# EasyEDA Pro project 延时继电器 -(4-11).eprj, board PCB
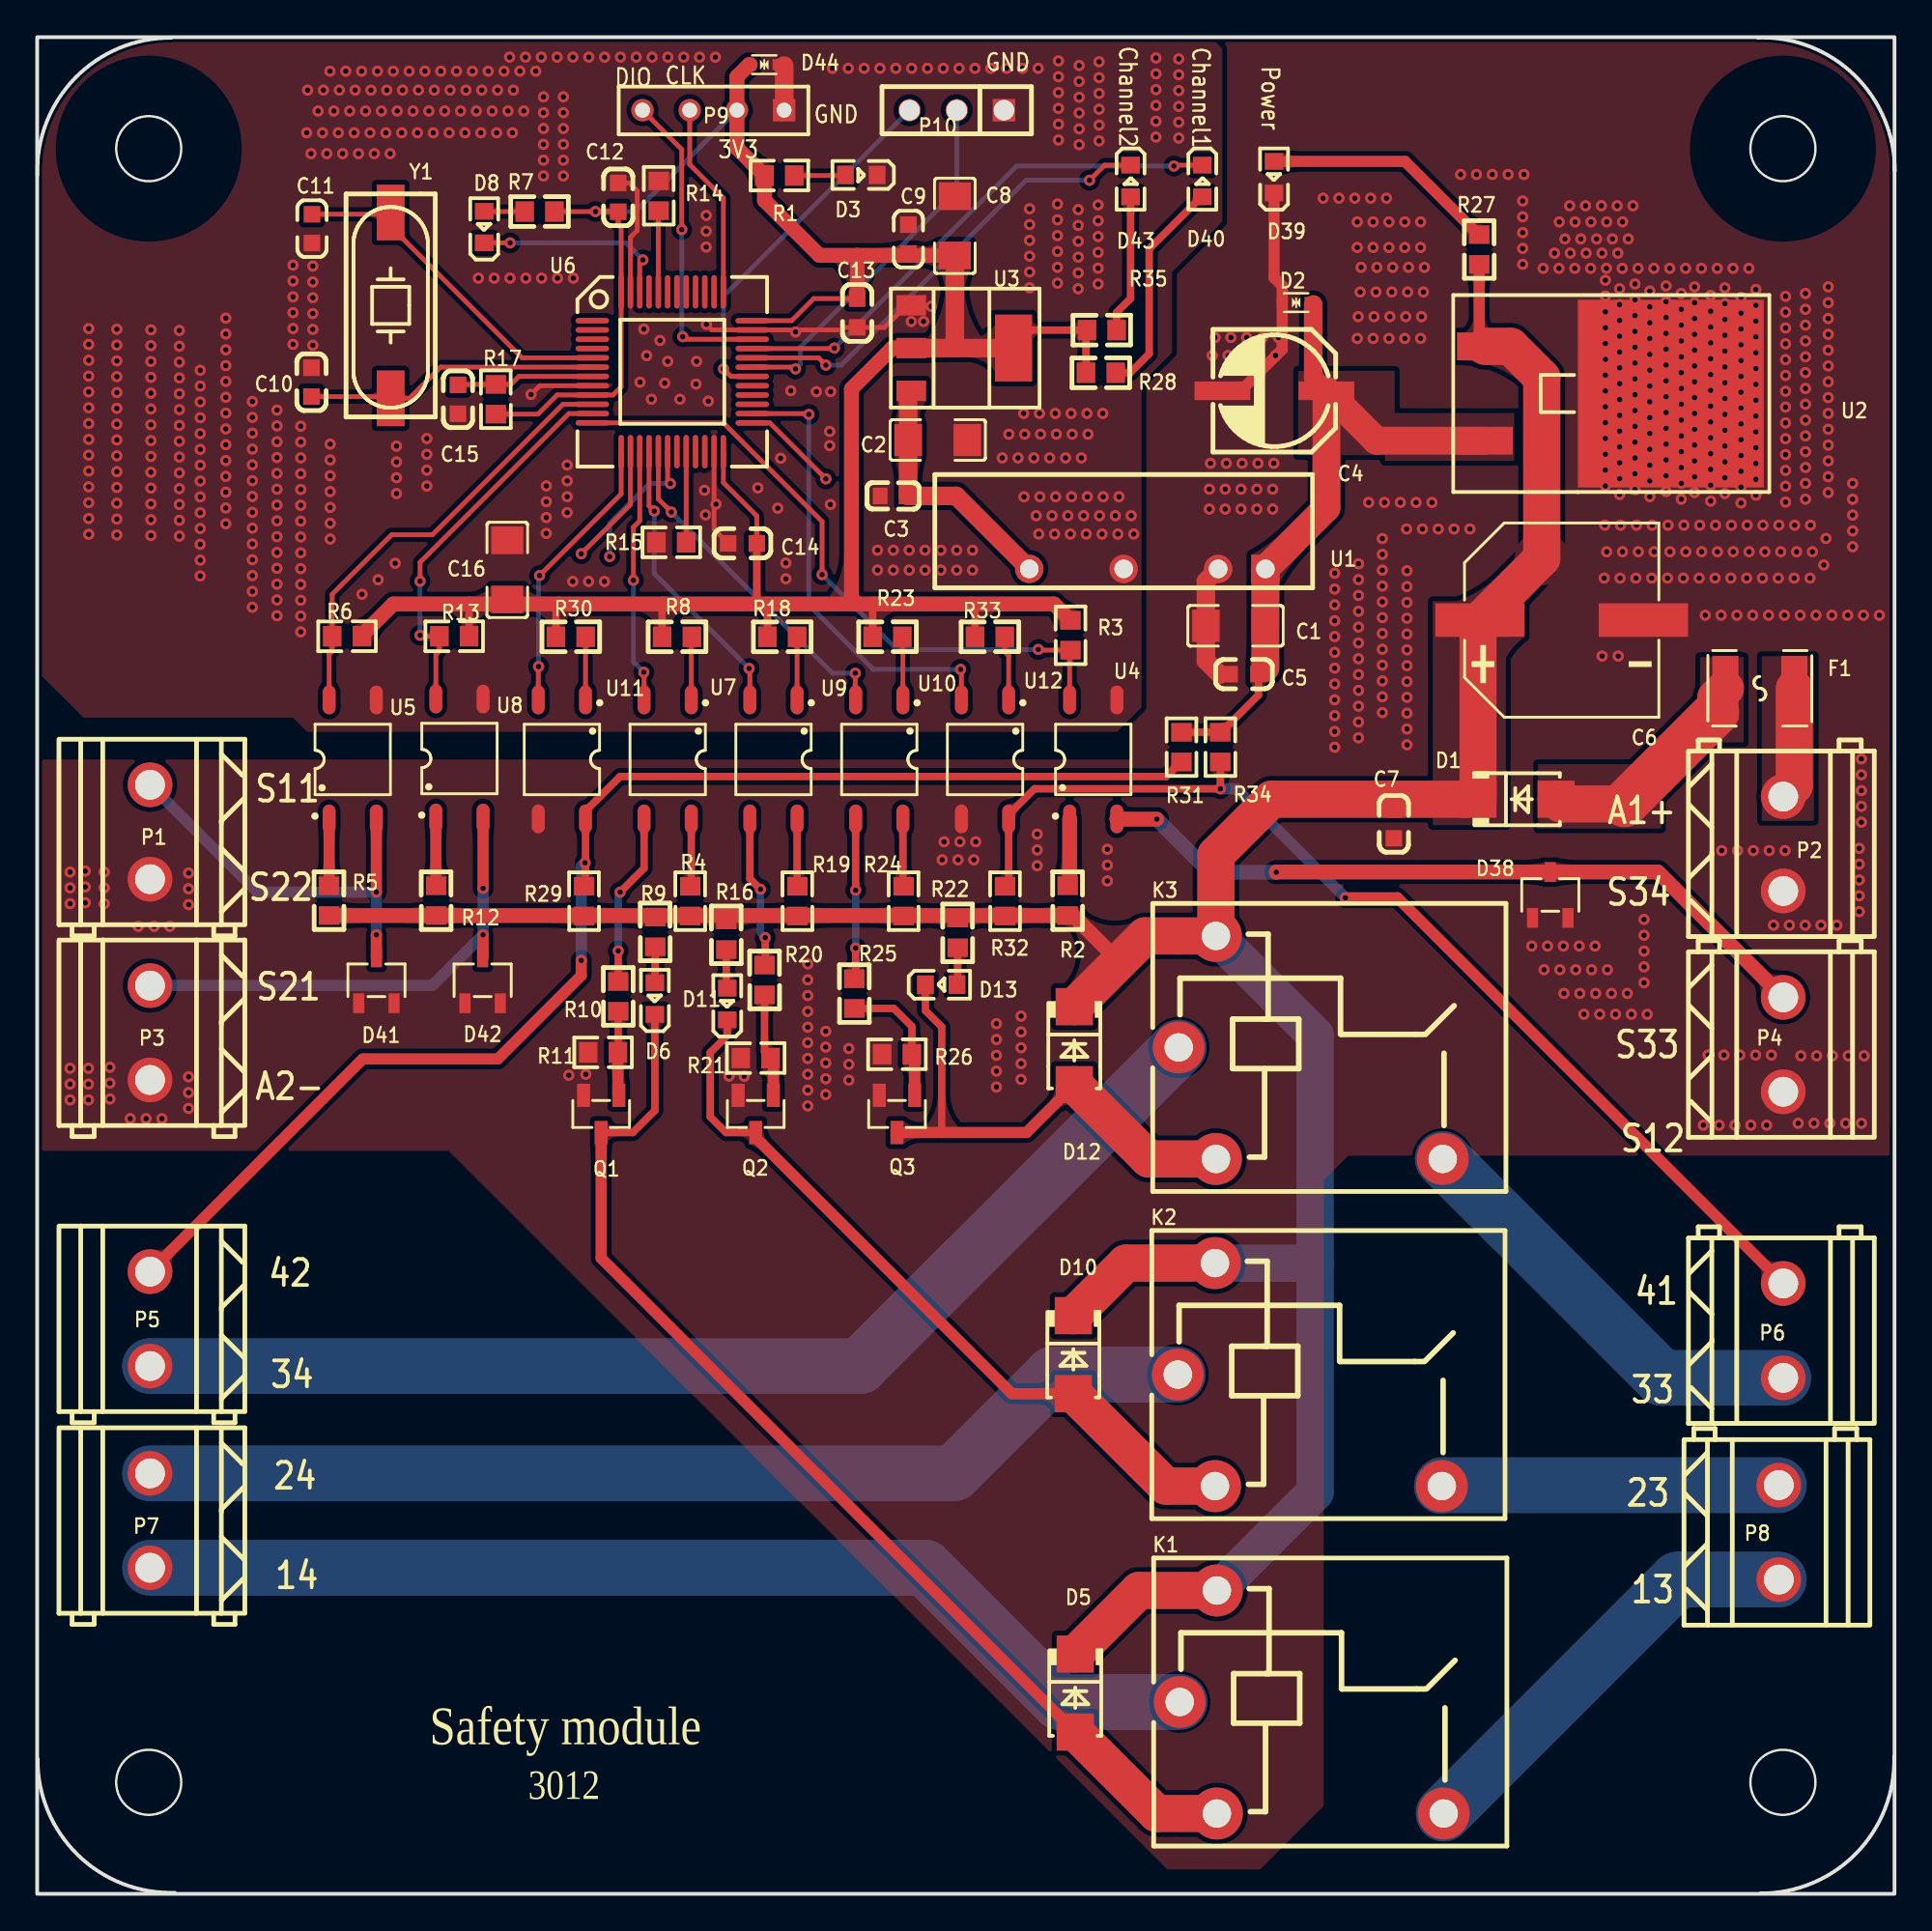
[diagram p2: board, top side]
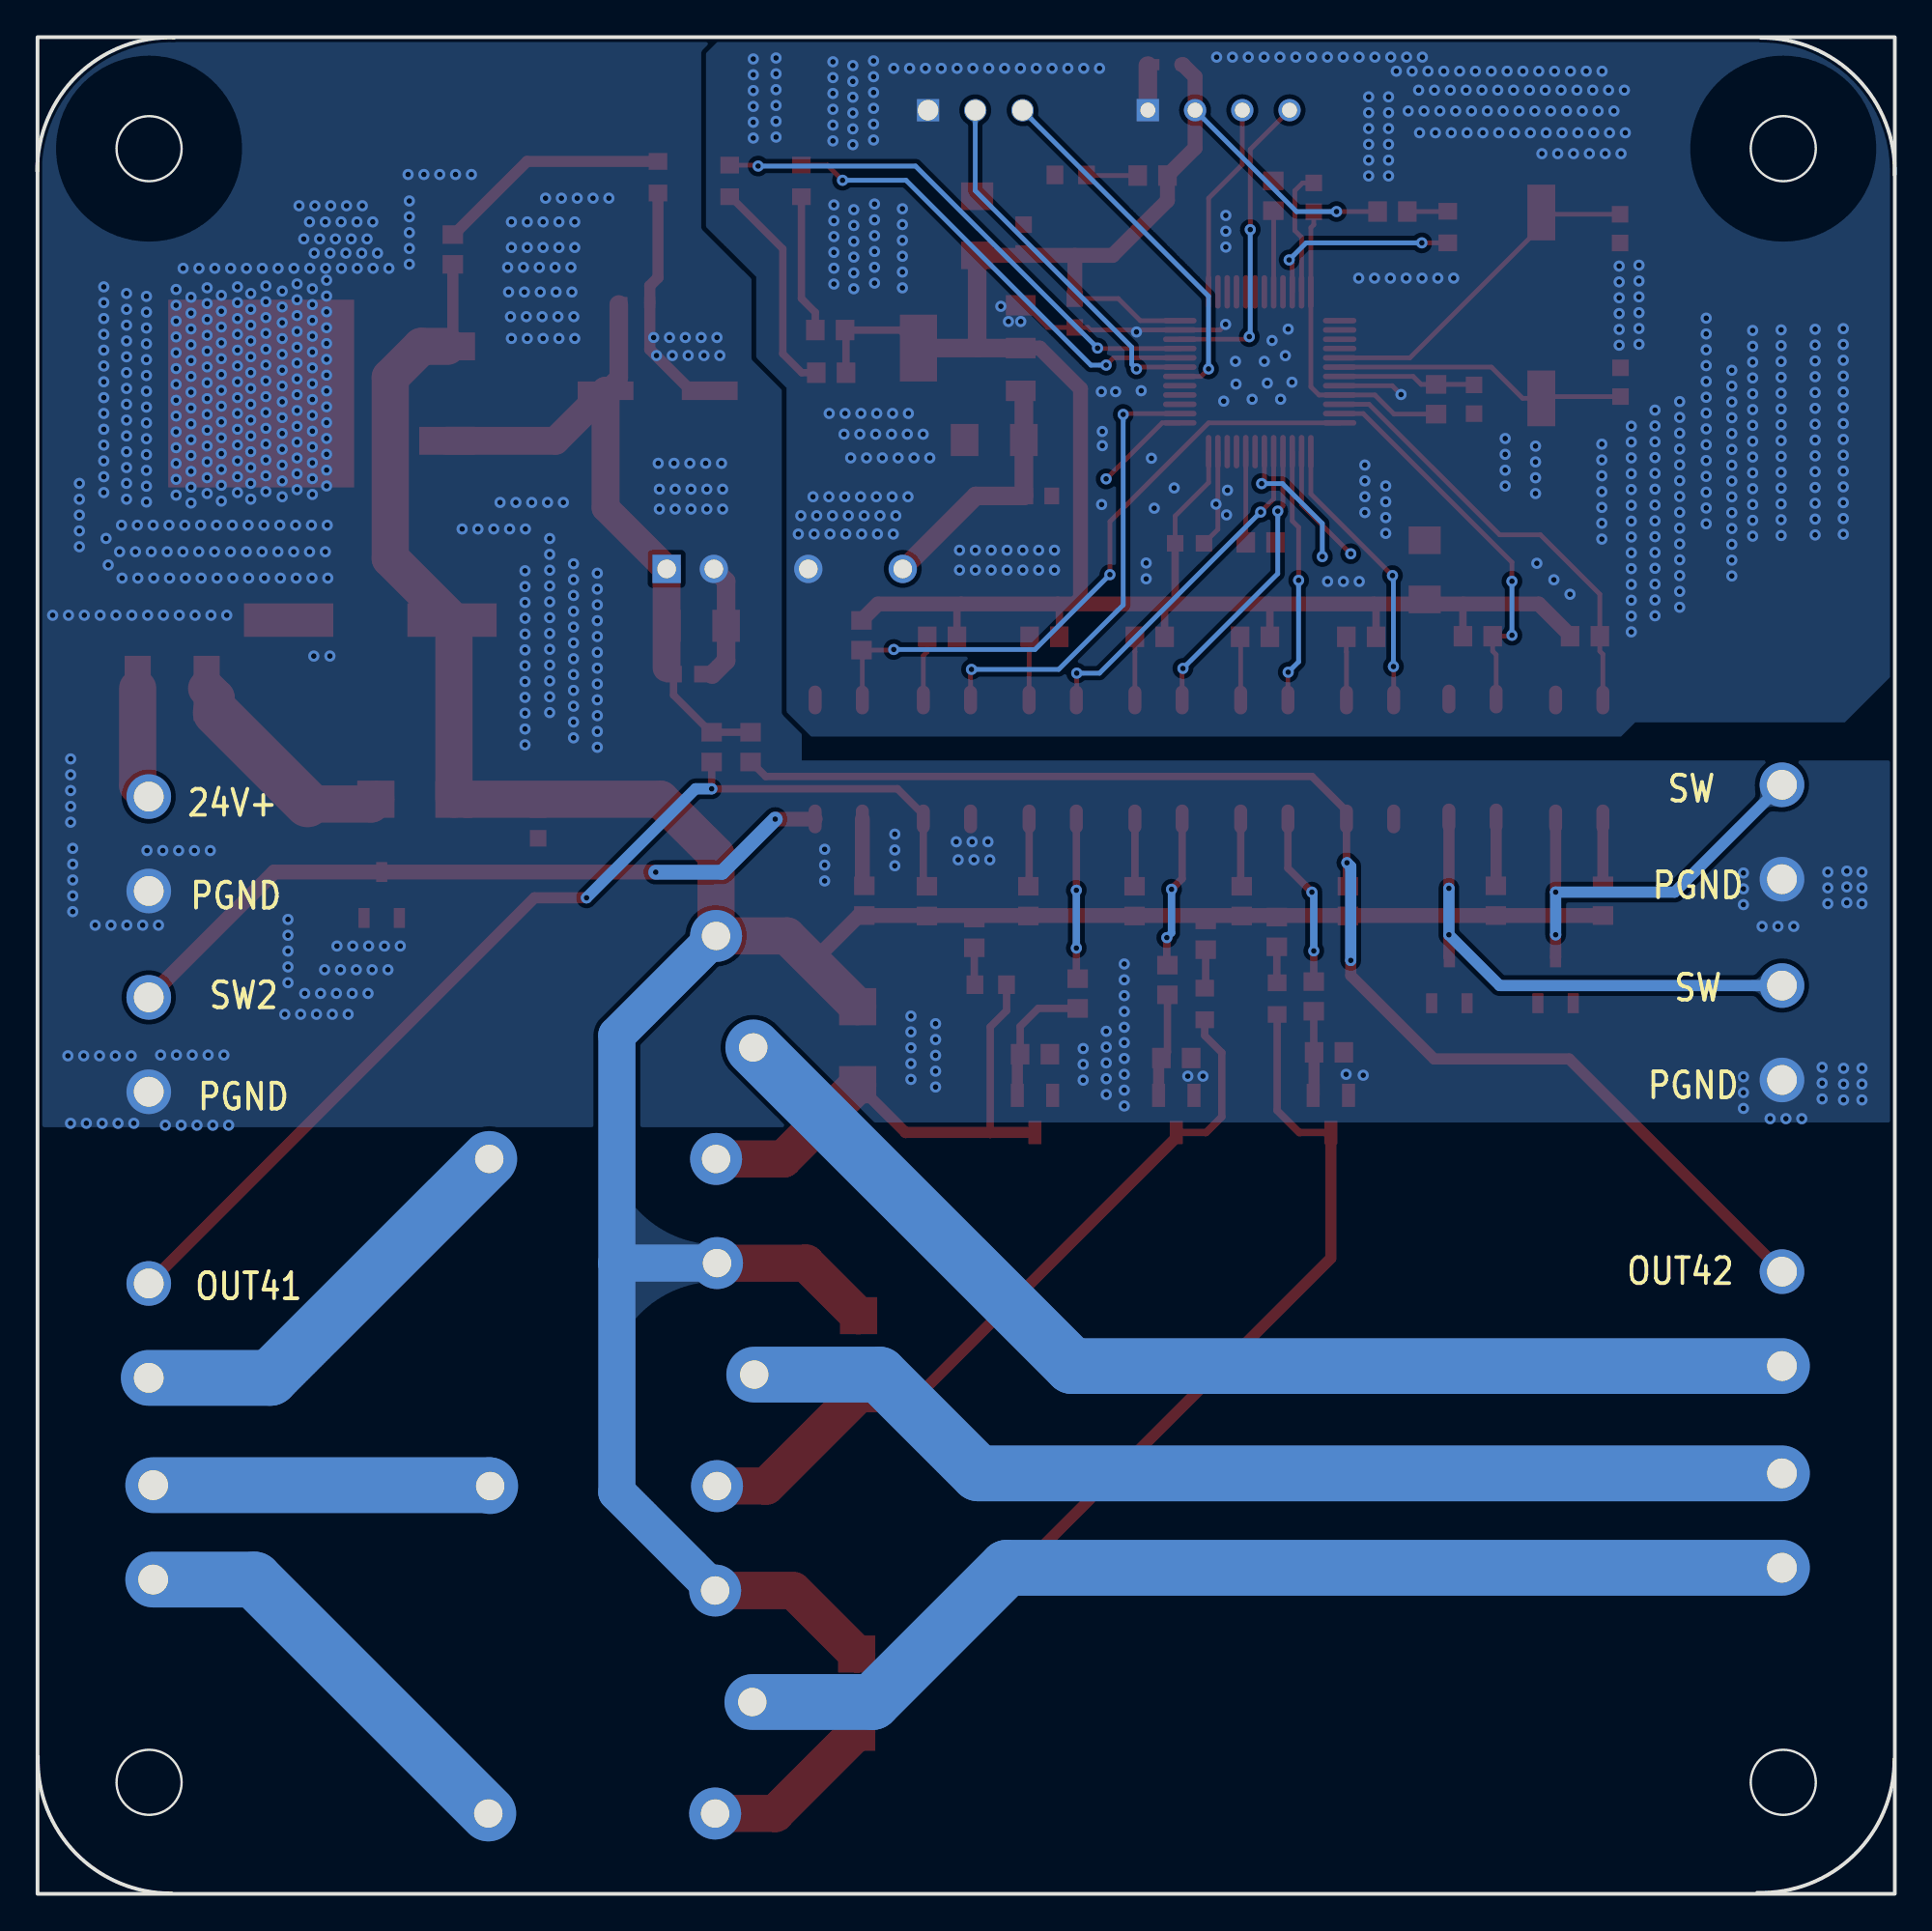
[diagram p3: board, bottom side, seen from below]

Outline 99.92 x 99.9 mm; copper layers: Top Layer, Bottom Layer. Coordinates in mm from the lower left corner of the outline.
Outline path: rectangle 0,99.9 99.9,0 ; circle c6,93.9 r1.75 ; circle c6,6 r1.75 ; circle c93.9,93.9 r1.75 ; circle c93.9,6 r1.75 ; 0.01,92.49 arc(2.04,97.7) 7.2,99.87 ; 7.4,0.06 arc(2.19,2.09) 0.02,7.25 ; 92.54,99.88 arc(97.75,97.85) 99.92,92.69 ; 99.88,7.4 arc(97.85,2.19) 92.69,0.02
Stack: Top Layer 0.035mm / Dielectric1 1.51mm FR4 er 4.5 / Bottom Layer 0.035mm

## Design rules (mm)
template: 用户自定义配置
spacing Default (default): track to track 0.152, other pairs 0 to 0.152
track width Default (default): min 0.254, default 0.254, max 25.4
differential pair differentialPair (default): width min 0.127, default 0.254, max 2.54; gap min 0.152, default 0.152
via Default (default): diameter min 0.25, default 0.61, max 100.025; hole min 0.2, default 0.305, max 59.995

## Placement (name value [footprint] x y rotation side)
C1  4.7uF  [C1206]  64.45 68.23 0 top
C2  4.7uF  [C1206]  48.44 78.22 180 top
C3  104  [C0603]  46.04 75.22 0 top
C4  100uF/35V  [电解电容贴片6X6]  66.55 80.88 180 top
C5  104  [0603C]  64.91 65.63 0 top
C6  100uF/50V  [CAP-SMD_BD10.0-L10.3-W10.3-LS11.0-R-RD]  82 68.53 180 top
C7  104  [0603C]  72.97 57.57 90 top
C8  4.7uF  [C1206]  49.36 89.75 270 top
C9  104  [0603C]  46.86 89.04 270 top
C10  100pF  [0603C]  14.75 81.34 90 top
C11  100pF  [0603C]  14.78 89.6 270 top
C12  104  [0603C]  31.25 91.28 270 top
C13  104  [0603C]  44.11 85.06 90 top
C14  104  [0603C]  37.93 72.67 0 top
C15  104  [0603C]  22.63 80.42 90 top
C16  4.7uF  [C1206]  25.29 71.24 270 top
D1  SS56  [SMA]  79.6 58.9 0 top
D2  PESD5V0L1BA-N  [SOD-523_L1.2-W0.8-LS1.6-BI]  67.72 85.62 0 top
D3  红光  [0603LED]  44.36 92.5 0 top
D5  SS56  [SMA]  55.84 10.8 270 top
D6  绿光  [0603LED]  33.24 48.13 270 top
D8  绿光  [0603LED]  24.06 89.65 270 top
D10  SS56  [SMA]  55.73 29.01 270 top
D11  绿光  [0603LED]  37.13 47.85 270 top
D12  SS56  [SMA]  55.78 45.63 270 top
D13  绿光  [0603LED]  48.59 48.9 180 top
D38  PESD24VL2BTN  [SOT-23-3_L2.9-W1.6-P1.90-LS2.8-BR]  81.39 53.74 270 top
D39  绿光  [0603LED]  66.55 92.33 270 top
D40  绿光  [0603LED]  62.65 92.2 90 top
D41  PESD24VL2BTN  [SOT-23-3_L2.9-W1.6-P1.90-LS2.8-BR]  18.25 49.15 270 top
D42  PESD24VL2BTN  [SOT-23-3_L2.9-W1.6-P1.90-LS2.8-BR]  23.96 49.15 270 top
D43  绿光  [0603LED]  58.79 92.2 90 top
D44  PESD3V3L1BA-N  [SOD-523_L1.2-W0.8-LS1.6-BI]  39.11 98.42 180 top
F1  mSMD030  [F1812]  92.66 64.86 180 top
K1  JQC-3FF/24VDC-1HS(551)  [RELAY-TH_JQC-3FF-1HXX]  68.55 10.32 0 top
K2  JQC-3FF/24VDC-1HS(551)  [RELAY-TH_JQC-3FF-1HXX]  68.45 27.94 0 top
K3  JQC-3FF/24VDC-1HS(551)  [RELAY-TH_JQC-3FF-1HXX]  68.5 45.54 0 top
P1  5.08-2P  [CONN-TH_2P-P5.08_DB128L-5.08-2P]  6.07 57.13 90 top
P2  5.08-2P  [CONN-TH_2P-P5.08_DB128L-5.08-2P]  93.92 56.5 270 top
P3  5.08-2P  [CONN-TH_2P-P5.08_DB128L-5.08-2P]  6.07 46.33 90 top
P4  5.08-2P  [CONN-TH_2P-P5.08_DB128L-5.08-2P]  93.92 45.7 270 top
P5  5.08-2P  [CONN-TH_2P-P5.08_DB128L-5.08-2P]  6.07 30.94 90 top
P6  5.08-2P  [CONN-TH_2P-P5.08_DB128L-5.08-2P]  93.92 30.3 270 top
P7  5.08-2P  [CONN-TH_2P-P5.08_DB128L-5.08-2P]  6.07 20.08 90 top
P8  5.08-2P  [CONN-TH_2P-P5.08_DB128L-5.08-2P]  93.68 19.45 270 top
P9  4P  [SIP4]  40.18 95.97 180 top
P10  PZ254V-11-03P  [HDR-TH_3P-P2.54-V-M]  49.46 95.97 180 top
Q1  SS8050  [SOT-23-3_L2.9-W1.3-P1.90-LS2.4-BR]  30.34 41.96 90 top
Q2  SS8050  [SOT-23-3_L2.9-W1.3-P1.90-LS2.4-BR]  38.65 41.96 90 top
Q3  SS8050  [SOT-23-3_L2.9-W1.3-P1.90-LS2.4-BR]  46.25 41.96 90 top
R1  50K  [0603R]  39.92 92.45 0 top
R2  10K  [0603R]  55.43 53.44 90 top
R3  10K  [0603R]  55.58 67.72 270 top
R4  10K  [0603R]  33.24 51.76 90 top
R5  10K  [0603R]  15.7 53.44 90 top
R6  10K  [0603R]  16.67 67.67 180 top
R7  10K  [0603R]  27.02 90.52 0 top
R8  1K  [0603R]  34.41 67.64 0 top
R9  10K  [0603R]  35.13 53.41 90 top
R10  1K  [0603R]  31.25 48.29 270 top
R11  10K  [0603R]  30.44 45.28 180 top
R12  10K  [0603R]  21.46 53.44 90 top
R13  10K  [0603R]  22.43 67.67 180 top
R14  10K  [0603R]  33.43 91.37 270 top
R15  10K  [0603R]  34.11 72.72 0 top
R16  10K  [0603R]  37.07 51.6 90 top
R17  10K  [0603R]  24.67 80.42 90 top
R18  1K  [0603R]  40.08 67.64 0 top
R19  10K  [0603R]  40.89 53.41 90 top
R20  1K  [0603R]  39.12 49.17 270 top
R21  10K  [0603R]  38.65 44.97 180 top
R22  10K  [0603R]  49.51 51.7 90 top
R23  1K  [0603R]  45.74 67.64 0 top
R24  10K  [0603R]  46.6 53.41 90 top
R25  1K  [0603R]  43.95 48.44 270 top
R26  10K  [0603R]  46.25 45.18 180 top
R27  47K  [0603R]  77.56 88.48 270 top
R28  10K  [0603R]  57.21 81.85 180 top
R29  10K  [0603R]  29.42 53.41 90 top
R30  1K  [0603R]  28.7 67.64 0 top
R31  10K  [0603R]  61.55 61.7 270 top
R32  10K  [0603R]  52.06 53.41 90 top
R33  1K  [0603R]  51.25 67.64 0 top
R34  10K  [0603R]  63.64 61.7 270 top
R35  10K  [0603R]  57.26 84.14 180 top
U1  B0505LS-1WR3  [PWRM-TH_BXXXXLS-1WR3]  59.71 71.29 180 top
U2  CJ7805  [TO-263-2]  77.87 80.72 180 top
U3  1117-3.3  [SOT-223]  49.72 83.17 270 top
U4  LTV-357T-C  [SOP-4_L4.4-W3.9-P2.54-LS7.0-TL]  56.8 61.04 90 top
U5  LTV-357T-C  [SOP-4_L4.4-W3.9-P2.54-LS7.0-TL]  16.97 61.04 90 top
U6  STM32F103C8T6/CBT6  [LQFP48]  34.16 81.9 0 top
U7  LTV-357T-C  [SOP-4_L4.4-W3.9-P2.54-LS7.0-TL]  33.91 61.04 270 top
U8  LTV-357T-C  [SOP-4_L4.4-W3.9-P2.54-LS7.0-TL]  22.71 61.09 90 top
U9  LTV-357T-C  [SOP-4_L4.4-W3.9-P2.54-LS7.0-TL]  39.6 61.04 270 top
U10  LTV-357T-C  [SOP-4_L4.4-W3.9-P2.54-LS7.0-TL]  45.29 61.04 270 top
U11  LTV-357T-C  [SOP-4_L4.4-W3.9-P2.54-LS7.0-TL]  28.22 61.04 270 top
U12  LTV-357T-C  [SOP-4_L4.4-W3.9-P2.54-LS7.0-TL]  50.98 61.04 270 top
Y1  8M  [晶振贴片]  19.01 85.47 270 top

## Footprints (pads in the part's own frame, mm; a bottom-side part is the same pattern mirrored in y, then rotated)
0603C
  rect 0.889x0.889 smd: 1(-0.774,0) 2(0.774,0)
0603LED
  rect 0.9x1 smd: 1(-0.884,-0.017) 2(0.816,-0.017)
0603R
  rect 1x1.1 smd: 1(-0.8,0) 2(0.8,0)
C0603
  rect 0.8x0.9 smd: 1(-0.7,0) 2(0.7,0)
C1206
  rect 1.485x1.728 smd: 1(-1.593,0) 2(1.593,0)
CAP-SMD_BD10.0-L10.3-W10.3-LS11.0-R-RD
  rect 4.8x1.8 smd: 1(4.395,0) 2(-4.395,0)
CONN-TH_2P-P5.08_DB128L-5.08-2P
  round 2.401 hole 1.6: 1(-2.54,0) 2(2.54,0)
F1812
  rect 1.407x3.499 smd: 1(-1.853,0) 2(1.853,0)
HDR-TH_3P-P2.54-V-M
  rect 1.2x1.2 hole 1.1x0.8: 1(-2.54,0)
  round 1.2 hole 1.1x0.8: 2(0,0) 3(2.54,0)
LQFP48
  oval 1.8x0.3 smd: 1(-4.3,2.75) 2(-4.3,2.25) 3(-4.3,1.75) 4(-4.3,1.25) 5(-4.3,0.75) 6(-4.3,0.25) 7(-4.3,-0.25) 8(-4.3,-0.75) 9(-4.3,-1.25) 10(-4.3,-1.75) 11(-4.3,-2.25) 12(-4.3,-2.75) 25(4.3,-2.75) 26(4.3,-2.25) 27(4.3,-1.75) 28(4.3,-1.25) 29(4.3,-0.75) 30(4.3,-0.25) 31(4.3,0.25) 32(4.3,0.75) 33(4.3,1.25) 34(4.3,1.75) 35(4.3,2.25) 36(4.3,2.75)
  oval 0.3x1.8 smd: 13(-2.75,-4.3) 14(-2.25,-4.3) 15(-1.75,-4.3) 16(-1.25,-4.3) 17(-0.75,-4.3) 18(-0.25,-4.3) 19(0.25,-4.3) 20(0.75,-4.3) 21(1.25,-4.3) 22(1.75,-4.3) 23(2.25,-4.3) 24(2.75,-4.3) 37(2.75,4.3) 38(2.25,4.3) 39(1.75,4.3) 40(1.25,4.3) 41(0.75,4.3) 42(0.25,4.3) 43(-0.25,4.3) 44(-0.75,4.3) 45(-1.25,4.3) 46(-1.75,4.3) 47(-2.25,4.3) 48(-2.75,4.3)
PWRM-TH_BXXXXLS-1WR3
  rect 1.524x1.524 hole 1: 1(-6.35,0)
  round 1.524 hole 1: 2(-3.81,0) 4(1.27,0) 6(6.35,0)
RELAY-TH_JQC-3FF-1HXX
  round 2.794 hole 1.524: 1(-5.1,6) 2(-5.1,-6) 3(7.1,-6) 4(-7.1,0)
SIP4
  rect 1.2x1.2 hole 0.8: 1(0,0)
  round 1.2 hole 0.8: 2(2.54,0) 3(5.08,0) 4(7.62,0)
SMA
  rect 2x2 smd: 1(2.1,0) 2(-2.1,0)
SOD-523_L1.2-W0.8-LS1.6-BI
  rect 0.6x0.6 smd: 1(-0.75,0) 2(0.75,0)
SOP-4_L4.4-W3.9-P2.54-LS7.0-TL
  oval 1.55x0.7 smd: 1(-3.2,1.27) 2(-3.2,-1.27) 3(3.2,-1.27) 4(3.2,1.27)
SOT-23-3_L2.9-W1.3-P1.90-LS2.4-BR
  rect 1.25x0.7 smd: 1(1,-0.95) 2(1,0.95) 3(-1,0)
SOT-23-3_L2.9-W1.6-P1.90-LS2.8-BR
  rect 1.07x0.6 smd: 1(1.235,-0.95) 2(1.235,0.95) 3(-1.235,0)
SOT-223
  rect 1.1x1.6 smd: 1(-2.3,-2.7) 2(0,-2.7) 3(2.3,-2.7)
  rect 3.6x2 smd: 4(0,2.8)
TO-263-2
  rect 3x1.5 smd: 1(0,-2.54) 3(0,2.54)
  rect 10x10.1 smd: 2(-10,0)
晶振贴片
  rect 3x1.5 smd: 1(-5,0) 2(5,0)
电解电容贴片6X6
  rect 3x1 smd: 1(-2.8,0) 2(2.8,0)

## Nets
As in the schematic.

Pads without a net: U6 1 2 3 4 18 21 22 45

## Via types
v1: diameter 0.6, hole 0.3, Top Layer to Bottom Layer, 1022 vias

## Routing (per net, layer and track width the routed paths; a pad name or vN(x,y) marks a point on that pad's centre or on a via; arc(x,y) is an arc through that point)
3V3: length 150.3
  Top Layer w0.254: 36.91,77.6 36.91,75.93 38.71,74.13 C14.2 ; R7.2 v1(30.03,90.52) 31.24,90.52 C12.2 31.25,89.81 31.41,89.65 U6.48 31.41,81.08 30.97,80.65 U6.9 27.96,80.65 26.93,79.62 R17.1 ; U6.36 40.58,84.65 41.77,85.83 C13.2
  Top Layer w0.4: U3.4 53.48,84.14 R35.2 56.41,84.09 R28.2 ; 28.02,69.4 27.9,69.28 R30.1 ; 39.25,69.4 39.28,69.38 39.28,67.64 ; 33.66,69.4 33.61,69.36 R8.1 ; 23.21,69.4 23.23,69.38 R13.1 ; C14.2 38.71,69.41 38.71,69.4 ; 50.22,69.4 50.45,69.17 R33.1 ; R23.1 44.94,69.32 45.02,69.4
  Top Layer w0.8: D44.2 38.29,98.42 37.64,97.77 P9.2 37.64,93.94 R1.1 39.12,91.11 42.08,88.16 44.11,88.16 ; R6.1 17.47,67.72 19.15,69.4 44.11,69.4 ; 44.11,69.4 43.8,69.72 43.8,80.98 45.99,83.17 U3.2 ; 44.11,69.4 54.7,69.4 55.58,68.52 ; C8.2 44.11,88.16 ; 44.11,88.16 C13.2
  Top Layer w1: C8.2 49.36,83.21 49.32,83.17 ; 49.32,83.17 U3.2 ; 49.32,83.17 U3.4
  Bottom Layer w0.254: P9.2 32.18,90.52 v1(30.03,90.52)
5V_MCU: length 13.9
  Top Layer w1: U3.3 46.85,80.7 46.85,75.22 49.43,75.22 U1.6
5V_VCC: length 36.9
  Top Layer w0.4: R31.1 R34.1 63.69,62.5 65.69,64.5 C5.2
  Top Layer w1: C4.1 68.64,81.59 68.64,85.52
  Top Layer w1.5: U2.3 72.04,78.18 C4.1 69.35,74.57 U1.1 66.06,65.96
24V: length 6.1
  Top Layer w2: P2.1 94.51,59.63 F1.1
PGND: length 19
  Top Layer w0.6: C4.2 64.75,80.88 66.97,83.1 D2.1 66.97,86.52 66.53,86.96 D39.2
  Top Layer w1: 63.61,65.6 62.86,66.35 C1.1 62.86,70.63 U1.2
  vias: v1(1.77,54.98) v1(1.77,54.13) v1(1.77,53.28) v1(1.77,44.42) v1(1.77,43.57) v1(1.77,42.72) v1(2.58,55.03) v1(2.58,54.18) v1(2.58,53.33) v1(2.76,44.42) v1(2.76,43.57) v1(2.76,42.72) v1(3.6,54.98) v1(3.6,54.13) v1(3.6,53.28) v1(3.91,44.47) v1(3.91,43.62) v1(3.91,42.77) v1(5,41.71) v1(5.44,52.05) v1(5.86,41.71) v1(6.29,52.05) v1(6.71,41.71) v1(7.14,52.05) v1(8.14,54.93) v1(8.14,54.08) v1(8.14,53.22) v1(8.14,43.96) v1(8.14,43.11) v1(8.14,42.26) v1(28.59,44.05) v1(29.51,44.1) v1(37.21,43.99) v1(38.03,43.99) v1(41.45,50.03) v1(41.45,49.18) v1(41.45,48.33) v1(41.45,47.48) v1(41.45,46.63) v1(41.45,45.8) v1(41.45,44.95) v1(41.45,44.1) v1(41.45,43.24) v1(41.45,42.39) v1(42.42,46.41) v1(42.42,45.56) v1(42.42,44.71) v1(42.42,43.86) v1(42.42,43) v1(43.66,45.48) v1(43.66,44.63) v1(43.66,43.78) v1(48.68,55.64) v1(48.78,56.61) v1(49.53,55.64) v1(49.63,56.61) v1(50.38,55.64) v1(50.48,56.61) v1(51.6,46.82) v1(51.6,45.97) v1(51.6,45.12) v1(51.6,44.26) v1(51.6,43.41) v1(52.92,47.23) v1(52.92,46.38) v1(52.92,45.52) v1(52.92,44.67) v1(52.92,43.82) v1(53.79,57.02) v1(53.79,56.17) v1(53.79,55.32) v1(57.56,56.2) v1(57.56,55.35) v1(57.56,54.5) v1(63.11,76.97) v1(63.05,75.58) v1(63.05,74.51) v1(63.2,82.77) v1(63.35,83.74) v1(63.9,75.58) v1(63.9,74.51) v1(63.96,76.97) v1(64.05,82.77) v1(64.21,83.74) v1(64.81,76.97) v1(64.75,75.58) v1(64.75,74.51) v1(64.9,82.77) v1(65.06,83.74) v1(65.6,75.58) v1(65.6,74.51) v1(65.66,76.97) v1(65.76,82.77) v1(65.91,83.74) v1(66.45,75.58) v1(66.45,74.51) v1(66.61,82.77) v1(66.51,76.97) v1(66.76,83.74) v1(69.17,91.24) v1(69.79,71.06) v1(69.79,70.2) v1(69.79,69.35) v1(69.79,68.5) v1(69.79,67.65) v1(69.79,66.8) v1(69.79,65.95) v1(69.79,65.1) v1(69.79,64.25) v1(69.79,63.39) v1(69.79,62.54) v1(69.79,61.69) v1(70.02,91.24) v1(70.87,91.24) v1(71,89.96) v1(71,88.58) v1(71,83.69) v1(71.06,84.86) v1(71.07,71.56) v1(71.07,70.71) v1(71.07,69.86) v1(71.07,69.01) v1(71.07,68.16) v1(71.07,67.31) v1(71.07,66.46) v1(71.07,65.6) v1(71.07,64.75) v1(71.07,63.9) v1(71.07,63.05) v1(71.07,62.2) v1(71.21,87.51) v1(71.16,86.19) v1(71.62,74.87) v1(71.72,91.24) v1(71.86,89.96) v1(71.86,88.58) v1(71.91,84.86) v1(71.86,83.69) v1(72.01,86.19) v1(72.06,87.51) v1(72.35,72.92) v1(72.35,72.07) v1(72.35,71.22) v1(72.35,70.37) v1(72.35,69.52) v1(72.35,68.67) v1(72.35,67.81) v1(72.35,66.96) v1(72.35,66.11) v1(72.35,65.26) v1(72.35,64.41) v1(72.35,63.56) v1(72.47,74.87) v1(72.57,91.24) v1(72.71,89.96) v1(72.71,88.58) v1(72.71,83.69) v1(72.76,84.86) v1(72.91,87.51) v1(72.86,86.19) v1(73.32,74.87) v1(73.56,89.96) v1(73.56,88.58) v1(73.61,84.86) v1(73.56,83.69) v1(73.71,86.19) v1(73.66,73.44) v1(73.68,71.19) v1(73.68,70.34) v1(73.68,69.49) v1(73.68,68.63) v1(73.68,67.78) v1(73.68,66.93) v1(73.68,66.08) v1(73.68,65.23) v1(73.68,64.38) v1(73.68,63.53) v1(73.68,62.68) v1(73.68,61.82) v1(73.76,87.51) v1(74.17,74.87) v1(74.41,89.96) v1(74.41,88.58) v1(74.41,83.69) v1(74.46,84.86) v1(74.51,73.44) v1(74.56,86.19) v1(74.61,87.51) v1(75.02,74.87) v1(75.36,73.44) v1(76.21,73.44) v1(76.56,92.51) v1(77.06,73.44) v1(77.41,92.51) v1(78.27,92.51) v1(79.12,92.51) v1(79.9,91.09) v1(79.9,90.24) v1(79.9,89.38) v1(79.9,88.53) v1(79.9,87.68) v1(79.97,92.51) v1(80.39,51) v1(81,87.46) v1(81.05,49.72) v1(81.24,51) v1(81.61,88.28) v1(81.87,89.96) v1(81.85,87.46) v1(81.9,49.72) v1(82.09,51) v1(82.17,89.04) v1(82.12,48.45) v1(82.43,90.83) v1(82.46,88.28) v1(82.7,87.46) v1(82.72,89.96) v1(82.75,49.72) v1(82.94,51) v1(82.97,48.45) v1(83.03,89.04) v1(83.19,47.33) v1(83.28,90.83) v1(83.32,88.28) v1(83.57,89.96) v1(83.55,87.46) v1(83.61,49.72) v1(83.79,51) v1(83.88,89.04) v1(83.83,48.45) v1(84.04,47.33) v1(84.13,90.83) v1(84.17,88.28) v1(84.17,66.6) v1(84.29,70.79) v1(84.41,87.46) v1(84.35,86.82) v1(84.35,85.97) v1(84.35,85.12) v1(84.35,84.27) v1(84.35,83.42) v1(84.35,82.56) v1(84.35,81.71) v1(84.35,80.86) v1(84.35,80.01) v1(84.35,79.16) v1(84.35,78.31) v1(84.35,77.46) v1(84.35,76.61) v1(84.35,75.75) v1(84.32,73.64) v1(84.42,89.96) v1(84.42,72.21) v1(84.46,49.72) v1(84.68,48.45) v1(84.73,89.04) v1(84.9,47.33) v1(84.98,90.83) v1(85.02,88.28) v1(85.04,66.6) v1(85.12,86.36) v1(85.12,85.51) v1(85.12,84.66) v1(85.12,83.81) v1(85.12,82.96) v1(85.12,82.11) v1(85.12,81.25) v1(85.12,80.4) v1(85.12,79.55) v1(85.12,78.7) v1(85.12,77.85) v1(85.12,77) v1(85.12,76.15) v1(85.12,75.3) v1(85.17,73.64) v1(85.14,70.79) v1(85.27,89.96) v1(85.26,87.46) v1(85.27,72.21) v1(85.58,89.04) v1(85.53,48.45) v1(85.75,47.33) v1(85.83,90.83) v1(85.94,86.62) v1(85.94,85.77) v1(85.94,84.92) v1(85.94,84.07) v1(85.94,83.22) v1(85.94,82.36) v1(85.94,81.51) v1(85.94,80.66) v1(85.94,79.81) v1(85.94,78.96) v1(85.94,78.11) v1(85.94,77.26) v1(85.94,76.41) v1(85.94,75.55) v1(85.99,70.79) v1(86.11,87.46) v1(86.02,73.64) v1(86.12,72.21) v1(86.43,52.43) v1(86.43,51.58) v1(86.43,50.73) v1(86.43,49.87) v1(86.43,49.02) v1(86.6,47.33) v1(86.74,86.24) v1(86.74,85.39) v1(86.74,84.54) v1(86.74,83.69) v1(86.74,82.83) v1(86.74,81.98) v1(86.74,81.13) v1(86.74,80.28) v1(86.74,79.43) v1(86.74,78.58) v1(86.74,77.73) v1(86.74,76.87) v1(86.74,76.02) v1(86.74,75.17) v1(86.87,73.64) v1(86.84,70.79) v1(86.96,87.46) v1(86.97,72.21) v1(87.62,86.52) v1(87.62,85.66) v1(87.62,84.81) v1(87.62,83.96) v1(87.62,83.11) v1(87.62,82.26) v1(87.62,81.41) v1(87.62,80.56) v1(87.62,79.7) v1(87.62,78.85) v1(87.62,78) v1(87.62,77.15) v1(87.62,76.3) v1(87.62,75.45) v1(87.69,70.79) v1(87.81,87.46) v1(87.72,73.64) v1(87.82,72.21) v1(88.43,86.11) v1(88.43,85.26) v1(88.43,84.41) v1(88.43,83.55) v1(88.43,82.7) v1(88.43,81.85) v1(88.43,81) v1(88.43,80.15) v1(88.43,79.3) v1(88.43,78.45) v1(88.43,77.59) v1(88.43,76.74) v1(88.43,75.89) v1(88.43,75.04) v1(88.57,73.64) v1(88.54,70.79) v1(88.66,87.46) v1(88.67,72.21) v1(89.15,86.47) v1(89.15,85.61) v1(89.15,84.76) v1(89.15,83.91) v1(89.15,83.06) v1(89.15,82.21) v1(89.15,81.36) v1(89.15,80.51) v1(89.15,79.65) v1(89.15,78.8) v1(89.15,77.95) v1(89.15,77.1) v1(89.15,76.25) v1(89.15,75.4) v1(89.39,70.79) v1(89.42,73.64) v1(89.51,87.46) v1(89.53,72.21) v1(89.62,41.36) v1(89.72,68.8) v1(89.88,45.13) v1(90.01,86.01) v1(90.01,85.15) v1(90.01,84.3) v1(90.01,83.45) v1(90.01,82.6) v1(90.01,81.75) v1(90.01,80.9) v1(90.01,80.05) v1(90.01,79.19) v1(90.01,78.34) v1(90.01,77.49) v1(90.01,76.64) v1(90.01,75.79) v1(90.01,74.94) v1(90.28,73.64) v1(90.25,70.79) v1(90.36,87.46) v1(90.38,72.21) v1(90.47,41.36) v1(90.57,68.8) v1(90.61,56.13) v1(90.78,86.41) v1(90.78,85.56) v1(90.78,84.71) v1(90.78,83.86) v1(90.78,83.01) v1(90.78,82.16) v1(90.78,81.31) v1(90.78,80.45) v1(90.78,79.6) v1(90.78,78.75) v1(90.78,77.9) v1(90.78,77.05) v1(90.78,76.2) v1(90.78,75.35) v1(90.73,45.13) v1(91.1,70.79) v1(91.13,73.64) v1(91.22,87.46) v1(91.23,72.21) v1(91.32,41.36) v1(91.42,68.8) v1(91.46,56.13) v1(91.58,45.13) v1(91.64,85.9) v1(91.64,85.05) v1(91.64,84.2) v1(91.64,83.35) v1(91.64,82.5) v1(91.64,81.65) v1(91.64,80.8) v1(91.64,79.94) v1(91.64,79.09) v1(91.64,78.24) v1(91.64,77.39) v1(91.64,76.54) v1(91.64,75.69) v1(91.64,74.84) v1(91.98,73.64) v1(91.95,70.79) v1(92.07,87.46) v1(92.08,72.21) v1(92.17,41.36) v1(92.28,68.8) v1(92.31,56.13) v1(92.44,86.33) v1(92.44,85.47) v1(92.44,84.62) v1(92.44,83.77) v1(92.44,82.92) v1(92.44,82.07) v1(92.44,81.22) v1(92.44,80.37) v1(92.44,79.51) v1(92.44,78.66) v1(92.44,77.81) v1(92.44,76.96) v1(92.44,76.11) v1(92.44,75.26) v1(92.43,45.13) v1(92.8,70.79) v1(92.83,73.64) v1(92.93,72.21) v1(93.03,41.36) v1(93.13,68.8) v1(93.16,56.13) v1(93.28,45.13) v1(93.39,52.12) v1(93.68,73.64) v1(93.65,70.79) v1(93.78,72.21) v1(93.98,68.8) v1(94.04,85.95) v1(94.04,85.1) v1(94.04,84.25) v1(94.04,83.4) v1(94.04,82.55) v1(94.04,81.7) v1(94.04,80.85) v1(94.04,80) v1(94.04,79.14) v1(94.04,78.29) v1(94.04,77.44) v1(94.04,76.59) v1(94.04,75.74) v1(94.04,74.89) v1(94.01,56.13) v1(94.25,52.12) v1(94.5,70.79) v1(94.53,73.64) v1(94.63,72.21) v1(94.72,41.46) v1(94.83,68.8) v1(94.86,45.09) v1(95.11,86.11) v1(95.11,85.26) v1(95.11,84.41) v1(95.11,83.55) v1(95.11,82.7) v1(95.11,81.85) v1(95.11,81) v1(95.11,80.15) v1(95.11,79.3) v1(95.11,78.45) v1(95.11,77.59) v1(95.11,76.74) v1(95.11,75.89) v1(95.11,75.04) v1(95.1,52.12) v1(95.38,73.64) v1(95.35,70.79) v1(95.48,72.21) v1(95.57,41.46) v1(95.68,68.8) v1(95.71,45.09) v1(95.95,52.12) v1(96.1,71.5) v1(96.21,72.93) v1(96.34,86.47) v1(96.34,85.61) v1(96.34,84.76) v1(96.34,83.91) v1(96.34,83.06) v1(96.34,82.21) v1(96.34,81.36) v1(96.34,80.51) v1(96.34,79.65) v1(96.34,78.8) v1(96.34,77.95) v1(96.34,77.1) v1(96.34,76.25) v1(96.34,75.4) v1(96.42,41.46) v1(96.53,68.8) v1(96.56,45.09) v1(96.8,52.12) v1(97.27,41.46) v1(97.38,68.8) v1(97.42,45.09) v1(97.65,75.89) v1(97.65,75.04) v1(97.65,74.19) v1(97.65,73.33) v1(97.65,72.48) v1(98.01,56.25) v1(98.01,55.4) v1(98.01,54.55) v1(98.01,53.7) v1(98.01,52.85) v1(98.12,61.06) v1(98.12,60.21) v1(98.12,59.36) v1(98.12,58.51) v1(98.12,57.66) v1(98.12,41.46) v1(98.23,68.8) v1(98.27,45.09) v1(99.09,68.8)
SGND: length 29.6
  Top Layer w0.254: U3.1 46.77,85.47 45.58,84.28 C13.1 43.41,84.28 43.27,84.15 U6.35 36.3,84.15 v1(36,84.45) ; U6.8 27.03,81.15 v1(26.56,80.67) ; 36.41,77.6 36.41,73.41 C14.1 ; C12.1 31.86,92.06 32.27,91.64 32.27,89.5 31.91,89.13 U6.47
  Top Layer w1: P9.1 40.18,98.37
  vias: v1(2.77,84.22) v1(2.77,83.37) v1(2.77,82.52) v1(2.77,81.66) v1(2.77,80.81) v1(2.77,79.96) v1(2.77,79.11) v1(2.77,78.26) v1(2.77,77.41) v1(2.77,76.56) v1(2.77,75.7) v1(2.77,74.85) v1(2.77,74) v1(2.77,73.15) v1(4.29,84.18) v1(4.29,83.33) v1(4.29,82.48) v1(4.29,81.63) v1(4.29,80.78) v1(4.29,79.93) v1(4.29,79.08) v1(4.29,78.23) v1(4.29,77.37) v1(4.29,76.52) v1(4.29,75.67) v1(4.29,74.82) v1(4.29,73.97) v1(4.29,73.12) v1(6.11,84.15) v1(6.11,83.3) v1(6.11,82.45) v1(6.11,81.6) v1(6.11,80.75) v1(6.11,79.89) v1(6.11,79.04) v1(6.11,78.19) v1(6.11,77.34) v1(6.11,76.49) v1(6.11,75.64) v1(6.11,74.79) v1(6.11,73.94) v1(6.11,73.08) v1(7.65,84.12) v1(7.65,83.27) v1(7.65,82.42) v1(7.65,81.56) v1(7.65,80.71) v1(7.65,79.86) v1(7.65,79.01) v1(7.65,78.16) v1(7.65,77.31) v1(7.65,76.46) v1(7.65,75.61) v1(7.65,74.75) v1(7.65,73.9) v1(7.65,73.05) v1(8.77,81.98) v1(8.77,81.13) v1(8.77,80.27) v1(8.77,79.42) v1(8.77,78.57) v1(8.77,77.72) v1(8.77,76.87) v1(8.77,76.02) v1(8.77,75.17) v1(8.77,74.31) v1(8.77,73.46) v1(8.77,72.61) v1(8.77,71.76) v1(8.77,70.91) v1(10.15,84.78) v1(10.15,83.93) v1(10.15,83.08) v1(10.15,82.23) v1(10.15,81.38) v1(10.15,80.52) v1(10.15,79.67) v1(10.15,78.82) v1(10.15,77.97) v1(10.15,77.12) v1(10.15,76.27) v1(10.15,75.42) v1(10.15,74.57) v1(10.15,73.71) v1(11.57,80.29) v1(11.57,79.44) v1(11.57,78.59) v1(11.57,77.74) v1(11.57,76.89) v1(11.57,76.04) v1(11.57,75.19) v1(11.57,74.33) v1(11.57,73.48) v1(11.57,72.63) v1(11.57,71.78) v1(11.57,70.93) v1(11.57,70.08) v1(11.57,69.23) v1(12.9,79.83) v1(12.9,78.98) v1(12.9,78.13) v1(12.9,77.28) v1(12.9,76.43) v1(12.9,75.58) v1(12.9,74.73) v1(12.9,73.88) v1(12.9,73.02) v1(12.9,72.17) v1(12.9,71.32) v1(12.9,70.47) v1(12.9,69.62) v1(12.9,68.77) v1(13.76,87.63) v1(13.76,86.78) v1(13.76,85.93) v1(13.76,85.08) v1(13.76,84.22) v1(13.76,83.37) v1(14.17,78.97) v1(14.17,78.12) v1(14.17,77.27) v1(14.17,76.41) v1(14.17,75.56) v1(14.17,74.71) v1(14.17,73.86) v1(14.17,73.01) v1(14.17,72.16) v1(14.17,71.31) v1(14.17,70.45) v1(14.17,69.6) v1(14.17,68.75) v1(14.17,67.9) v1(14.5,94.76) v1(14.55,97.05) v1(14.73,93.63) v1(14.83,87.58) v1(14.83,86.73) v1(14.83,85.88) v1(14.83,85.03) v1(14.83,84.18) v1(14.83,83.33) v1(15.11,95.93) v1(15.4,97.05) v1(15.35,94.76) v1(15.58,93.63) v1(15.75,98.07) v1(15.76,78) v1(15.76,77.15) v1(15.76,76.3) v1(15.76,75.45) v1(15.76,74.6) v1(15.76,73.75) v1(15.76,72.89) v1(15.96,95.93) v1(16.2,94.76) v1(16.25,97.05) v1(16.43,93.63) v1(16.6,98.07) v1(16.81,95.93) v1(17.1,97.05) v1(17.05,94.76) v1(17.28,93.63) v1(17.45,98.07) v1(17.47,69.92) v1(17.66,95.93) v1(17.9,94.76) v1(17.95,97.05) v1(18.13,93.63) v1(18.3,98.07) v1(18.34,70.7) v1(18.51,95.93) v1(18.8,97.05) v1(18.75,94.76) v1(18.98,93.63) v1(19.15,98.07) v1(19.26,71.59) v1(19.36,95.93) v1(19.33,77.9) v1(19.33,77.05) v1(19.33,76.19) v1(19.33,75.34) v1(19.6,94.76) v1(19.65,97.05) v1(20,98.07) v1(20.22,95.93) v1(20.51,97.05) v1(20.45,94.76) v1(20.85,98.07) v1(20.96,78.3) v1(20.96,77.45) v1(20.96,76.6) v1(20.96,75.75) v1(21.07,95.93) v1(21.31,94.76) v1(21.36,97.05) v1(21.71,98.07) v1(21.92,95.93) v1(22.21,97.05) v1(22.16,94.76) v1(22.56,98.07) v1(22.77,95.93) v1(23.01,94.76) v1(23.06,97.05) v1(23.41,98.07) v1(23.62,95.93) v1(23.73,86.93) v1(23.91,97.05) v1(23.86,94.76) v1(24.26,98.07) v1(24.47,95.93) v1(24.58,86.93) v1(24.71,94.76) v1(24.76,97.05) v1(25.11,98.07) v1(25.41,98.83) v1(25.32,95.93) v1(25.43,86.93) v1(25.56,94.76) v1(25.61,97.05) v1(25.96,98.07) v1(26.17,95.93) v1(26.26,98.83) v1(26.28,86.93) v1(26.81,98.07) v1(27.11,98.83) v1(27.13,86.93) v1(27.23,96.69) v1(27.23,95.84) v1(27.23,94.99) v1(27.23,94.13) v1(27.23,93.28) v1(27.23,92.43) v1(27.38,75.75) v1(27.38,74.9) v1(27.38,74.05) v1(27.38,73.2) v1(27.97,98.83) v1(27.99,86.93) v1(28.3,96.69) v1(28.3,95.84) v1(28.3,94.99) v1(28.3,94.13) v1(28.3,93.28) v1(28.3,92.43) v1(28.51,76.88) v1(28.51,76.03) v1(28.51,75.17) v1(28.51,74.32) v1(28.81,70.61) v1(28.82,98.83) v1(28.84,86.93) v1(29.67,98.83) v1(29.66,70.61) v1(30.51,70.61) v1(30.52,98.83) v1(31.37,98.83) v1(32.22,98.83) v1(32.43,81.34) v1(32.63,84.19) v1(32.78,82.76) v1(33.07,98.83) v1(33.04,80.42) v1(33.5,83.58) v1(33.75,81.28) v1(33.91,82.46) v1(33.92,98.83) v1(34.57,80.42) v1(34.78,98.83) v1(35.47,82.46) v1(35.44,81.23) v1(35.63,98.83) v1(35.89,75.52) v1(35.98,90.31) v1(35.98,89.46) v1(35.98,88.61) v1(35.94,74.2) v1(36.1,80.32) v1(36.48,98.83) v1(36.51,74.77) v1(38.76,75.65) v1(39.83,74.56) v1(39.99,77.24) v1(40.27,71.61) v1(40.27,70.76) v1(40.53,80.88) v1(40.79,84.04) v1(41.91,80.83) v1(42.68,80.83) v1(42.63,78.69) v1(42.63,77.92) v1(42.67,74.75) v1(42.78,98.22) v1(43.63,98.22) v1(44.48,98.22) v1(45.2,72.3) v1(45.2,71.23) v1(45.33,98.22) v1(46.05,72.3) v1(46.05,71.23) v1(46.18,98.22) v1(46.9,72.3) v1(46.9,71.23) v1(47.03,98.22) v1(47.01,84.6) v1(47.68,84.6) v1(47.75,72.3) v1(47.75,71.23) v1(47.89,98.22) v1(48.08,85.42) v1(48.61,72.3) v1(48.61,71.23) v1(48.74,98.22) v1(49.46,72.3) v1(49.46,71.23) v1(49.59,98.22) v1(50.31,72.3) v1(50.31,71.23) v1(50.44,98.22) v1(51.29,98.22) v1(51.91,77.26) v1(52.14,98.22) v1(52.26,78.54) v1(52.76,77.26) v1(52.99,98.22) v1(53.06,79.65) v1(53.08,75.17) v1(53.11,78.54) v1(53.38,90.67) v1(53.38,89.82) v1(53.38,88.97) v1(53.38,88.11) v1(53.38,87.26) v1(53.38,86.41) v1(53.61,77.26) v1(53.73,74.15) v1(53.84,98.22) v1(53.91,79.65) v1(53.87,73.16) v1(53.97,78.54) v1(53.93,75.17) v1(54.46,77.26) v1(54.59,74.15) v1(54.76,79.65) v1(54.78,75.17) v1(54.72,73.16) v1(54.88,90.92) v1(54.88,90.07) v1(54.88,89.22) v1(54.88,88.37) v1(54.88,87.52) v1(54.88,86.67) v1(54.82,78.54) v1(54.93,98.62) v1(54.93,97.77) v1(54.93,96.92) v1(54.93,96.07) v1(54.93,95.22) v1(54.93,94.37) v1(55.31,77.26) v1(55.44,74.15) v1(55.57,73.16) v1(55.61,79.65) v1(55.67,78.54) v1(55.63,75.17) v1(56,90.62) v1(56,89.77) v1(56,88.92) v1(56,88.07) v1(56,87.21) v1(56,86.36) v1(56.05,98.37) v1(56.05,97.52) v1(56.05,96.67) v1(56.05,95.82) v1(56.05,94.97) v1(56.05,94.11) v1(56.16,77.26) v1(56.29,74.15) v1(56.46,79.65) v1(56.48,75.17) v1(56.42,73.16) v1(56.52,78.54) v1(57.07,90.87) v1(57.07,90.02) v1(57.07,89.17) v1(57.07,88.32) v1(57.07,87.47) v1(57.07,86.62) v1(57.12,98.58) v1(57.12,97.72) v1(57.12,96.87) v1(57.12,96.02) v1(57.12,95.17) v1(57.12,94.32) v1(57.14,74.15) v1(57.28,73.16) v1(57.32,79.65) v1(57.34,75.17) v1(57.99,74.15) v1(58.19,75.17) v1(58.13,73.16) v1(58.84,74.15) v1(58.98,73.16) v1(60.18,98.78) v1(60.18,97.93) v1(60.18,97.08) v1(60.18,96.23) v1(60.18,95.37) v1(60.18,94.52) v1(61.4,98.73) v1(61.4,97.88) v1(61.4,97.03) v1(61.4,96.17) v1(61.4,95.32) v1(61.4,94.47)
VIN_24V: length 166.4
  Top Layer w0.6: R27.2 77.56,83.57 U2.1
  Top Layer w0.8: R5.1 R12.1 55.72,52.64 57.77,50.58
  Top Layer w2: 76.85,58.95 76.8,58.9 66.39,58.9 63.4,55.9 K3.1 59.59,51.54 D12.2 ; D10.2 58.56,33.94 K2.1 ; K1.1 59.25,16.32 D5.2 ; U2.1 79.25,83.26 80.93,81.59 80.93,71.86 C6.1 77.5,68.43 D1.2
  Bottom Layer w2: 68.74,33.93 68.74,21.61 K1.1 ; 68.74,33.93 68.74,46.2 K3.1 ; 68.74,33.93 68.73,33.94 K2.1
(no net): length 7.7
  Top Layer w0.254: v1(34.06,75.88) 33.91,76.03 33.91,77.6
  Bottom Layer w0.254: v1(30.79,71.95) 30.79,73.74 32.94,75.88 v1(34.06,75.88)
BOOT0: length 4.4
  Top Layer w0.254: U6.44 33.41,90.55 R14.2
BOOT1: length 4.9
  Top Layer w0.254: 34.91,77.6 R15.2
CH1: length 28.3
  Top Layer w0.254: v1(61.14,92.96) 61.19,93.02 D40.2 ; U6.33 42.86,83.15 v1(42.88,83.17)
  Bottom Layer w0.254: v1(42.88,83.17) 52.67,92.96 v1(61.14,92.96)
CH2: length 25
  Top Layer w0.254: v1(56.6,92.2) 57.42,93.02 D43.2 ; v1(42.42,82.25) 42.03,82.65 U6.32
  Bottom Layer w0.254: v1(56.6,92.2) 53.18,92.2 43.24,82.25 v1(42.42,82.25)
J13: length 23.2
  Bottom Layer w3: P8.2 88.24,16.91 K1.3
J14: length 58.4
  Bottom Layer w3: P7.1 47.77,17.54 54.99,10.32 K1.4
J23: length 18.1
  Bottom Layer w3: P8.1 75.6,21.99 75.55,21.94
J24: length 57.5
  Bottom Layer w3: K2.4 54.61,27.94 49.3,22.62 P7.2
J33: length 23.2
  Bottom Layer w3: 75.6,39.54 87.38,27.76 P6.2
J34: length 62.4
  Bottom Layer w3: K3.4 44.26,28.4 P5.1
LED_SYS: length 10.7
  Top Layer w0.254: U6.46 32.41,87.75 v1(32.58,87.91) ; v1(25.44,88.83) D8.2
  Bottom Layer w0.254: v1(32.58,87.91) 31.66,88.83 v1(25.44,88.83)
MISO: length 15.6
  Top Layer w0.254: 32.91,77.6 32.91,74.68 v1(33.19,74.4) ; v1(38.29,65.93) 38.33,65.89 38.33,64.24
  Bottom Layer w0.254: v1(33.19,74.4) 33.19,71.03 v1(38.29,65.93)
MOSI: length 18.5
  Top Layer w0.254: 33.41,77.6 33.41,75.05 v1(34.11,74.35) ; v1(44,65.68) 44,64.26 U10.2
  Bottom Layer w0.254: v1(34.11,74.35) 42.78,65.68 v1(44,65.68)
NRST: length 7.4
  Top Layer w0.254: U6.7 25.91,81.65 25.48,81.22 R17.2 22.66,81.22 C15.2
OUT41: length 58.6
  Top Layer w0.4: R32.2 52.25,54.4 U12.4 52.25,58.07 53.64,59.46 v1(63.64,59.46) R34.2
  Top Layer w0.6: v1(70.37,53.59) 73.17,53.59 P6.1
  Bottom Layer w0.6: v1(63.64,59.46) 64.51,59.46 v1(70.37,53.59)
OUT42: length 73.2
  Top Layer w0.4: R31.2 61.51,60.9 60.73,60.12 31.35,60.12 29.49,58.26 U11.4 29.49,54.29 R29.2
  Top Layer w0.6: v1(29.26,50.23) 29.26,49.41 24.78,44.92 17.51,44.92 P5.2
  Bottom Layer w0.6: v1(29.26,50.23) 29.26,55.27 v1(29.47,55.48)
PA0: length 24
  Top Layer w0.254: 29.91,80.15 28.28,80.15 21.26,73.12 19.06,73.12 15.87,69.93 R6.2 15.87,66.86 15.7,66.7 U5.4
PA1: length 21
  Top Layer w0.254: 21.44,64.29 21.44,66.68 21.63,66.86 R13.2 20.64,67.67 v1(20.59,67.72) ; v1(20.59,70.63) 20.59,71.65 28.59,79.65 U6.11
  Bottom Layer w0.254: v1(20.59,70.63) v1(20.59,67.72)
PA2: length 35.2
  Top Layer w0.254: v1(42.22,70.98) 42.22,73.84 36.91,79.15 U6.12 ; v1(53.85,66.95) 53.88,66.92 R3.2 55.53,66.87 U4.4
  Bottom Layer w0.254: v1(53.85,66.95) 46.25,66.95 v1(42.22,70.98)
PA3: length 15.2
  Top Layer w0.254: U11.2 26.95,66.02 v1(26.97,66.04) ; 31.41,77.6 31.41,75.32 v1(27.02,70.93)
  Bottom Layer w0.254: v1(26.97,66.04) 26.97,70.88 v1(27.02,70.93)
PA4: length 6.6
  Top Layer w0.254: v1(29.26,72.1) 31.91,74.75 31.91,77.6
PB12: length 5.2
  Top Layer w0.254: U6.25 39.41,79.15 v1(42.42,76.13)
PB13: length 24.6
  Top Layer w0.254: U6.26 41.46,79.65 v1(41.5,79.6) ; v1(49.66,65.88) 49.71,65.83 U12.2
  Bottom Layer w0.254: v1(41.5,79.6) 41.5,69.35 44.97,65.88 v1(49.66,65.88)
RXD: length 19.9
  Top Layer w0.254: v1(40.79,82.05) 40.69,82.15 U6.31
  Bottom Layer w0.254: v1(40.79,82.05) 41.04,82.3 41.04,83.22 49.46,91.64 P10.2
S11: length 22
  Top Layer w0.6: v1(18.24,51.6) 18.24,50.39 D41.3 ; U5.2 v1(18.24,53.9)
  Bottom Layer w0.6: v1(18.24,51.6) v1(18.24,53.9) 11.84,53.9 P1.2
S21: length 26.6
  Top Layer w0.6: D42.3 23.98,50.41 v1(23.98,51.6) ; U8.2 v1(23.98,54.1)
  Bottom Layer w0.6: v1(23.98,54.1) v1(23.98,51.6) 21.25,48.87 P3.2
S33: length 39.8
  Top Layer w0.8: P4.1 87.17,54.98 D38.3 66.66,54.98 v1(66.65,54.97) ; U4.2 58.09,57.82 v1(60.22,57.82)
  Bottom Layer w0.8: v1(66.65,54.97) 63.08,54.97 v1(60.22,57.82)
SCLK: length 13.7
  Top Layer w0.254: v1(32.07,70.68) 32.07,73.53 32.41,73.87 32.41,77.6 ; U7.2 32.64,65.72 v1(32.63,65.73)
  Bottom Layer w0.254: v1(32.63,65.73) 32.07,66.29 v1(32.07,70.68)
SWCLK: length 10.5
  Top Layer w0.254: U6.37 36.91,91.23 35.1,93.05 P9.3
SWDIO: length 16.9
  Top Layer w0.254: P9.4 34.67,93.86 v1(34.67,89.55) ; v1(34.72,83.78) 34.86,83.65 U6.34
  Bottom Layer w0.254: v1(34.67,89.55) 34.67,83.83 v1(34.72,83.78)
TXD: length 19.8
  Top Layer w0.254: v1(36.91,82.05) 37.32,81.65 U6.30
  Bottom Layer w0.254: v1(36.91,82.05) 36.91,85.96 P10.3
XTAL1: length 18.8
  Top Layer w0.254: C11.1 18.92,90.37 Y1.1 19.01,89.72 26.08,82.65 U6.5
XTAL2: length 15.8
  Top Layer w0.254: U6.6 21.7,82.15 20.02,80.47 Y1.2 18.92,80.56 C10.1
$1N53807: length 2.2
  Top Layer w0.254: R7.1 24.06,90.52 24.04,90.53
$1N53854: length 3.6
  Top Layer w0.8: R2.2 55.53,54.34 U4.1
$1N55881: length 2.8
  Top Layer w0.254: R1.2 43.44,92.45 D3.1
$1N57449: length 12.2
  Top Layer w2: F1.2 90.29,64.35 90.29,63.56 ; 85.37,58.64 81.96,58.64 D1.1
  Top Layer w2.5: 85.37,58.64 90.29,63.56
$1N58958: length 3.6
  Top Layer w0.6: U5.1 15.7,54.24 R5.2
$1N59162: length 3.7
  Top Layer w0.6: 21.44,57.89 21.44,54.25 R12.2
$1N59368: length 3.4
  Top Layer w0.254: U7.1 35.18,67.6 R8.2
$1N59371: length 3.6
  Top Layer w0.4: U7.4 35.18,54.27 R9.2
$1N59536: length 9.3
  Top Layer w0.4: v1(31.25,50.74) R10.1 ; v1(31.35,53.9) 32.64,55.19 U7.3
  Bottom Layer w0.4: v1(31.35,53.9) 31.25,53.8 v1(31.25,50.74)
$1N59597: length 1.9
  Top Layer w0.4: D6.1 33.24,49.03 R4.1
$1N59599: length 4.6
  Top Layer w0.4: R10.2 31.25,45.29 R11.1
  Top Layer w0.6: Q1.1 31.24,43.01 R11.1
$1N59629: length 60.8
  Top Layer w0.4: Q1.3 32.04,40.96 33.22,42.15 D6.2
  Top Layer w0.6: D5.1 30.34,34.2 Q1.3
  Top Layer w2: K1.2 60.22,4.32 D5.1
$1N60118: length 3.4
  Top Layer w0.254: R18.2 40.88,66.83 40.87,66.83 U9.1
$1N60120: length 3.6
  Top Layer w0.4: R19.2 40.87,54.23 U9.4
$1N60129: length 8.2
  Top Layer w0.4: 38.33,57.84 38.33,54.62 v1(38.9,54.05) ; R20.1 39.16,50 v1(39.16,51.45)
  Bottom Layer w0.4: v1(38.9,54.05) 38.9,51.7 v1(39.16,51.45)
$1N60134: length 2.1
  Top Layer w0.4: R16.1 37.07,48.78 D11.1
$1N60136: length 5.6
  Top Layer w0.4: R21.1 39.12,45.3 R20.2
  Top Layer w0.6: Q2.1 39.6,44.82 R21.1
$1N60139: length 41.1
  Top Layer w0.4: Q2.3 37.05,40.96 36.2,41.81 36.2,45.26 37.12,46.18 D11.2
  Top Layer w0.6: D10.1 52.43,26.91 38.65,40.69 Q2.3
  Top Layer w2: K2.2 60.7,21.94 D10.1
$1N60524: length 3.4
  Top Layer w0.254: R23.2 46.54,66.83 46.56,66.8 U10.1
$1N60526: length 3.6
  Top Layer w0.4: U10.4 46.56,54.25 R24.2
$1N60535: length 8.6
  Top Layer w0.4: R25.1 44.02,49.31 v1(44.02,50.89) ; U10.3 v1(44.02,54)
  Bottom Layer w0.4: v1(44.02,54) v1(44.02,50.89)
$1N60540: length 2
  Top Layer w0.4: D13.1 49.51,48.95 R22.1
$1N60542: length 7.3
  Top Layer w0.4: R26.1 47.05,46.67 46.08,47.64 R25.2
  Top Layer w0.6: R26.1 47.2,45.03 Q3.1
$1N60545: length 28.3
  Top Layer w0.4: D13.2 47.78,47.52 48.65,46.64 48.65,40.96 ; 46.19,40.96 46.14,40.91
  Top Layer w0.6: D12.1 53.21,40.96 Q3.3
  Top Layer w2: D12.1 59.78,39.54 K3.2
$1N62733: length 12.7
  Top Layer w0.6: R27.1 77.51,89.28 73.57,93.21 D39.1
$1N62788: length 11.9
  Top Layer w0.4: R28.1 58.79,81.85 59.81,82.87 59.81,88.51 62.62,91.31 D40.1
$1N64965: length 3.4
  Top Layer w0.254: R30.2 29.5,66.83 29.49,66.82 U11.1
$1N65241: length 3.5
  Top Layer w0.254: R33.2 52.04,66.83 52.25,66.62 U12.1
$1N65547: length 7.5
  Top Layer w0.4: D43.1 58.81,85.84 58.06,85.09 R35.1

## Copper pours and planes (outline as drawn; the poured copper is in the pictures)
5V_VCC on Top Layer: 67.82,81.95 73.02,81.95 73.02,77.41 67.82,77.41
5V_VCC on Top Layer: 72.5,79.68 79.45,79.68 79.45,77.1 72.5,77.1
24V on Top Layer: 92.76,66.6 95.56,66.6 95.56,57.73 92.76,57.73
PGND on Top Layer: 58.84,102.96 102.14,102.96 102.14,41.2 58.84,41.2
PGND on Top Layer: -1.41,61.04 100.77,61.04 102.35,59.46 102.35,40.94 101.12,39.72 70.52,39.72 69.2,38.39 69.2,4.73 65.78,1.32 60.78,1.32 22.12,39.97 -1.34,39.97 -1.41,40.04
PGND on Bottom Layer: 58.79,103.01 102.09,103.01 102.09,41.25 58.79,41.25
PGND on Bottom Layer: -1.9,60.99 63.54,60.99 63.54,41.5 -1.9,41.5
SGND on Top Layer: -0.88,100.66 -0.88,66.65 2.49,63.28 13.76,63.28 14.52,62.52 58.08,62.52 59.41,63.84 59.41,81.28 61.04,82.92 61.04,87.25 63.74,89.95 63.74,99.29 62.36,100.66
SGND on Bottom Layer: -0.67,100.41 -0.67,66.39 2.69,63.03 13.96,63.03 14.73,62.26 58.28,62.26 59.61,63.59 59.61,81.03 61.24,82.66 61.24,87 63.94,89.7 63.94,99.03 62.57,100.41
VIN_24V on Top Layer: 75.06,69.55 79,69.55 79,57.5 75.06,57.5
$1N57449 on Top Layer: 89.44,66.55 91.79,66.55 91.79,61.96 89.44,61.96
$1N57449 on Top Layer: 80.72,60.78 87.35,60.78 87.35,57.31 80.72,57.31

Small or netless copper shapes (teardrops, artwork), in the pictures only: 300 on Top Layer, 42 on Bottom Layer

## Text on the board
Bottom Silkscreen Layer: SW | PGND | OUT42 | SW2 | OUT41 | 24V+
Top Silkscreen Layer: DIO | CLK | 3V3 | GND | Channel2 | Channel1 | Power | S22 | S11 | A2- | S21 | 42 | 34 | 24 | 14 | S34 | A1+ | S33 | S12 | 23 | 33 | 13 | 41 | 3012 | Safety module
